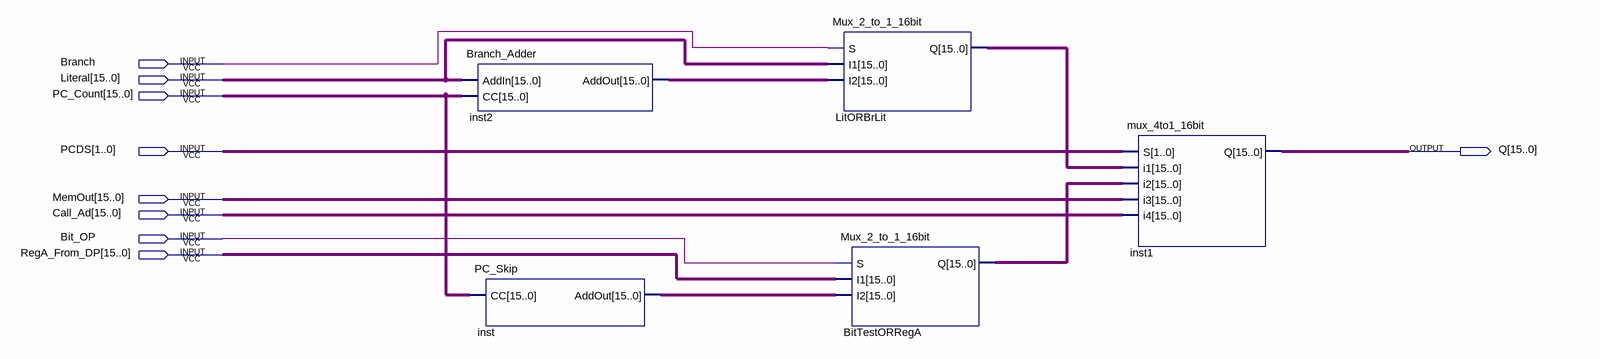
[diagram p0: schematic sheet]
// Quartus schematic CU_PC_Pathing.bdf as structural Verilog: 5 symbols, 9 pins
module CU_PC_Pathing (
  input  Branch,
  input  [15:0] Literal,
  input  [15:0] PC_Count,
  input  [1:0] PCDS,
  input  [15:0] MemOut,
  input  [15:0] Call_Ad,
  input  Bit_OP,
  input  [15:0] RegA_From_DP,
  output [15:0] Q
);

  wire [15:0] BitTestORRegA_q, inst2_addout, inst_addout, LitORBrLit_q;

  Branch_Adder inst2 (.AddIn(Literal), .CC(PC_Count), .AddOut(inst2_addout));
  PC_Skip inst (.CC(PC_Count), .AddOut(inst_addout));
  Mux_2_to_1_16bit LitORBrLit (.S(Branch), .I1(Literal), .I2(inst2_addout), .Q(LitORBrLit_q));
  Mux_2_to_1_16bit BitTestORRegA (.S(Bit_OP), .I1(RegA_From_DP), .I2(inst_addout), .Q(BitTestORRegA_q));
  mux_4to1_16bit inst1 (.S(PCDS), .i1(LitORBrLit_q), .i2(BitTestORRegA_q), .i3(MemOut), .i4(Call_Ad), .Q(Q));
endmodule
